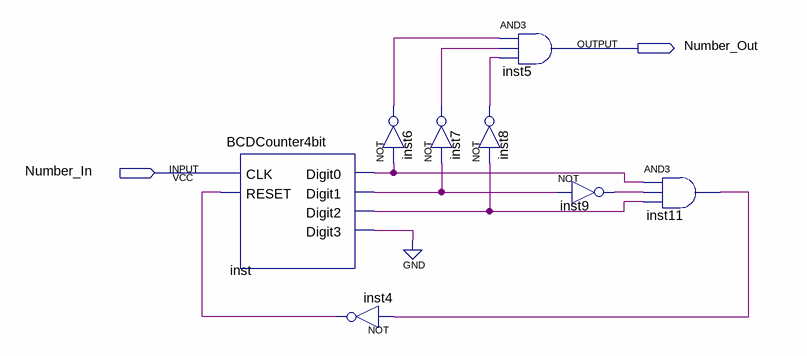
[diagram p0: schematic sheet]
// Quartus schematic divideBy5.bdf as structural Verilog: 8 symbols, 2 pins
module divideBy5 (
  input  Number_In,
  output Number_Out
);

  wire inst4_out, inst6_out, inst7_out, inst8_out, inst9_out, inst11_out, inst_digit0, inst_digit1,
       inst_digit2, inst_digit3;

  BCDCounter4bit inst (
    .CLK(Number_In), .RESET(inst4_out), .Digit0(inst_digit0), .Digit1(inst_digit1), .Digit2(inst_digit2),
    .Digit3(inst_digit3));
  not inst4 (inst4_out, inst11_out);
  not inst6 (inst6_out, inst_digit0);
  not inst7 (inst7_out, inst_digit1);
  and inst5 (Number_Out, inst6_out, inst7_out, inst8_out);
  not inst8 (inst8_out, inst_digit2);
  not inst9 (inst9_out, inst_digit1);
  and inst11 (inst11_out, inst_digit0, inst9_out, inst_digit2);
  // also tied to GND on the sheet: inst_digit3
endmodule
